# EAGLE design 3w developer dcdc test (EAGLE 5.07)
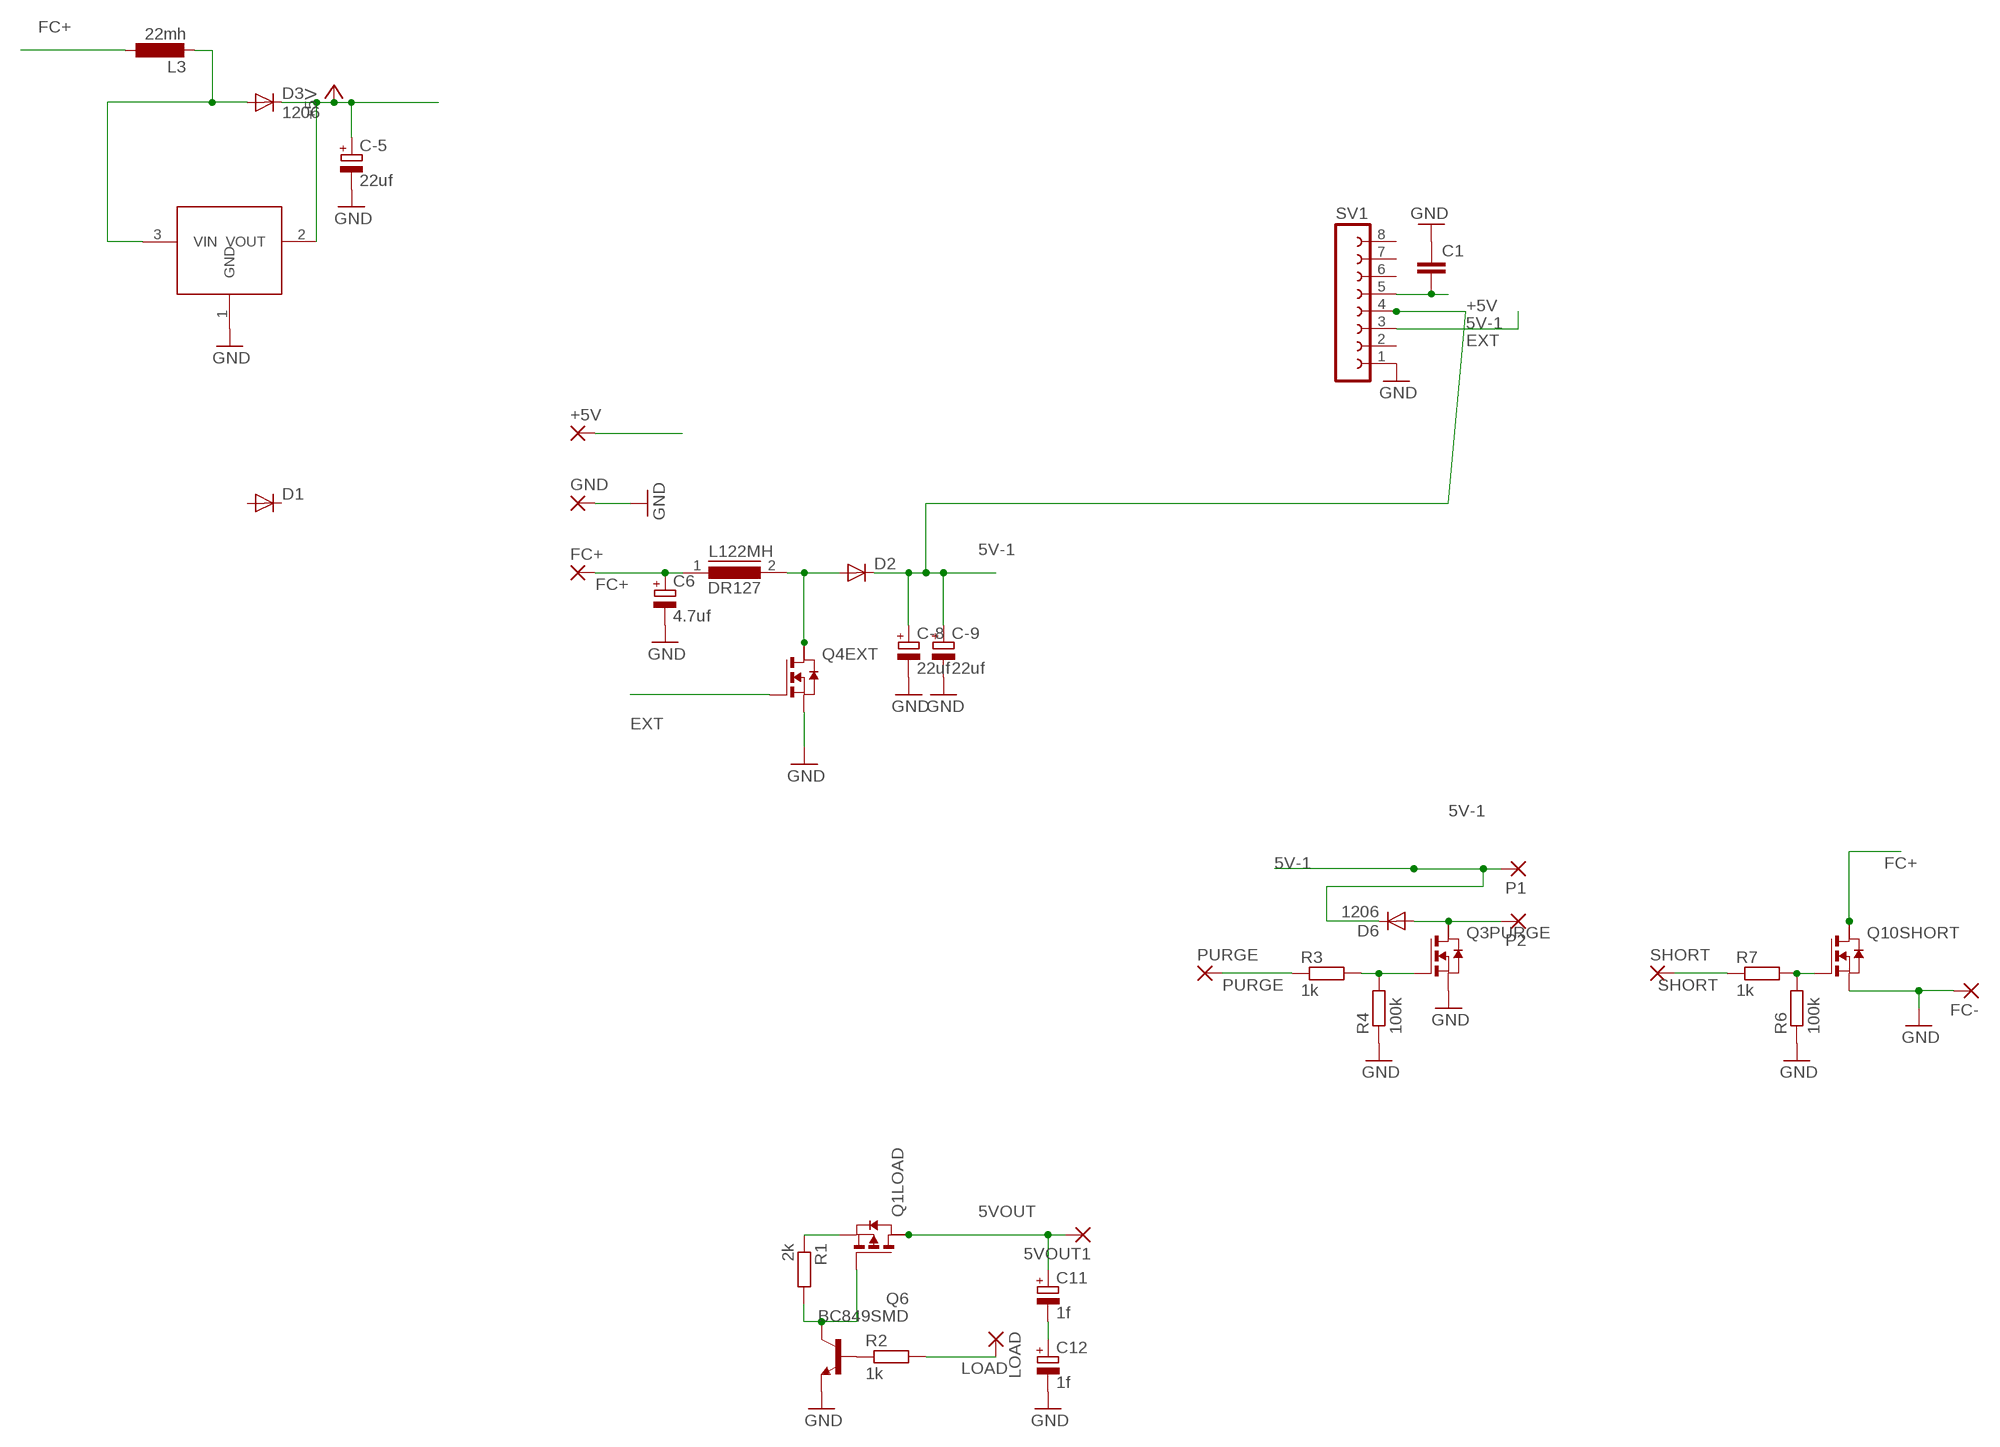
[diagram p0: schematic, sheet 1]

## Parts
5VOUT1  2,54/1,1  [2,54/1,1]
+5V  2,54/1,1  [2,54/1,1]
C1  C-EUC1206  [C1206]
C6  4.7uf  CPOL-EUSMCC  [SMC_C]
C11  1f  CPOL-EUE5-10.5  [E5-10,5]
C12  1f  CPOL-EUE5-10.5  [E5-10,5]
C-5  22uf  CPOL-EUSMCD  [SMC_D]
C-8  22uf  CPOL-EUSMCD  [SMC_D]
C-9  22uf  CPOL-EUSMCC  [SMC_C]
D1  DIODE-DO214AA  [DO214AA]
D2  DIODE-DO214AA  [DO214AA]
D3  1206  DIODE-DO214AA  [DO214AA]
D6  1206  DIODE-GF1  [GF1]
FC+  2,54/1,1  [2,54/1,1]
FC-  2,54/1,1  [2,54/1,1]
GND  2,54/1,1  [2,54/1,1]
L3  22mh  L-EU  [MURATA-45223]
L122MH  DR127  [DR127]
LOAD  2,54/1,1  [2,54/1,1]
P1  2,54/1,1  [2,54/1,1]
P2  2,54/1,1  [2,54/1,1]
PURGE  2,54/1,1  [2,54/1,1]
Q1LOAD  PMOSSOT223  [SOT223]
Q3PURGE  NMOSSOT223  [SOT223]
Q4EXT  NMOSSOT223  [SOT223]
Q6  BC849SMD  [SOT23-BEC]
Q10SHORT  NMOSSOT223  [SOT223]
R1  2k  R-EU_M1206  [M1206]
R2  1k  R-EU_M1206  [M1206]
R3  1k  R-EU_M1206  [M1206]
R4  100k  R-EU_M1206  [M1206]
R6  100k  R-EU_M1206  [M1206]
R7  1k  R-EU_M1206  [M1206]
SHORT  2,54/1,1  [2,54/1,1]
SV1  FE08-1  [FE08]
U$2  MINIPAK-7750  [SOT89]

## Nets
5V-1: C-8.+ C-9.+ D2.C D6.C P1.1(P) Q1LOAD.3(S) R1.1 SV1.4
5VOUT: 5VOUT1.1(P) C11.+ Q1LOAD.2(D)
+5V [medpower]: +5V.1(P) C1.2 C-5.+ D3.C SV1.5 U$2.2(VOUT)
EXT: Q4EXT.1(G) SV1.3
FC+: C6.+ FC+.1(P) L3.P$1 L122MH.1 Q10SHORT.2(D)
GND: C1.1 C6.- C12.- C-5.- C-8.- C-9.- FC-.1(P) GND.1(P) Q3PURGE.3(S) Q4EXT.3(S) Q6.E Q10SHORT.3(S) R4.1 R6.1 SV1.1 U$2.1(GND)
LOAD: LOAD.1(P) R2.2
N$2: Q1LOAD.1(G) Q6.C R1.2
N$3: D2.A L122MH.2 Q4EXT.2(D)
N$4: D6.A P2.1(P) Q3PURGE.2(D)
N$5: Q6.B R2.1
N$6: D3.A L3.P$2 U$2.3(VIN)
N$7: Q3PURGE.1(G) R3.2 R4.2
N$8: C11.- C12.+
N$9: Q10SHORT.1(G) R6.2 R7.2
PURGE: PURGE.1(P) R3.1
SHORT: R7.1 SHORT.1(P)
Unconnected: D1.A D1.C Q1LOAD.4(D2) Q3PURGE.4(D2) Q4EXT.4(D2) Q10SHORT.4(D2) SV1.2 SV1.6 SV1.7 SV1.8

## Library data of the parts
5VOUT1 +5V FC+ FC- GND LOAD P1 P2 PURGE SHORT = wirepad:2,54/1,1: THROUGH-HOLE PAD
C1 = matt rcl:C-EU: CAPACITOR, European symbol
C6 C-9 = rcl:CPOL-EU: POLARIZED CAPACITOR, European symbol
C11 C12 C-5 C-8 = matt rcl:CPOL-EU: POLARIZED CAPACITOR, European symbol
D1-D3 D6 = matt diode:DIODE-: DIODE
L3 = matt rcl:L-EU: INDUCTOR, European symbol
L122MH = inductors:DR127: High Power Density, High Efficiency, Shielded Inductors Source: coiltronics_dr_series.pdf
Q1LOAD = zetex:PMOSSOT223: MOS FET
Q3PURGE Q4EXT Q10SHORT = zetex:NMOSSOT223: MOS FET
Q6 = matt transistor-npn:BC849*: NPN Transistor
R1-R4 R6 R7 = resistor:R-EU_: RESISTOR, European symbol
SV1 = con-lsta:FE08-1: FEMALE HEADER
U$2 = matt:MINIPAK-7750

## Net classes
1 power: width 3 mm
2 medpower: width 1 mm

## Board
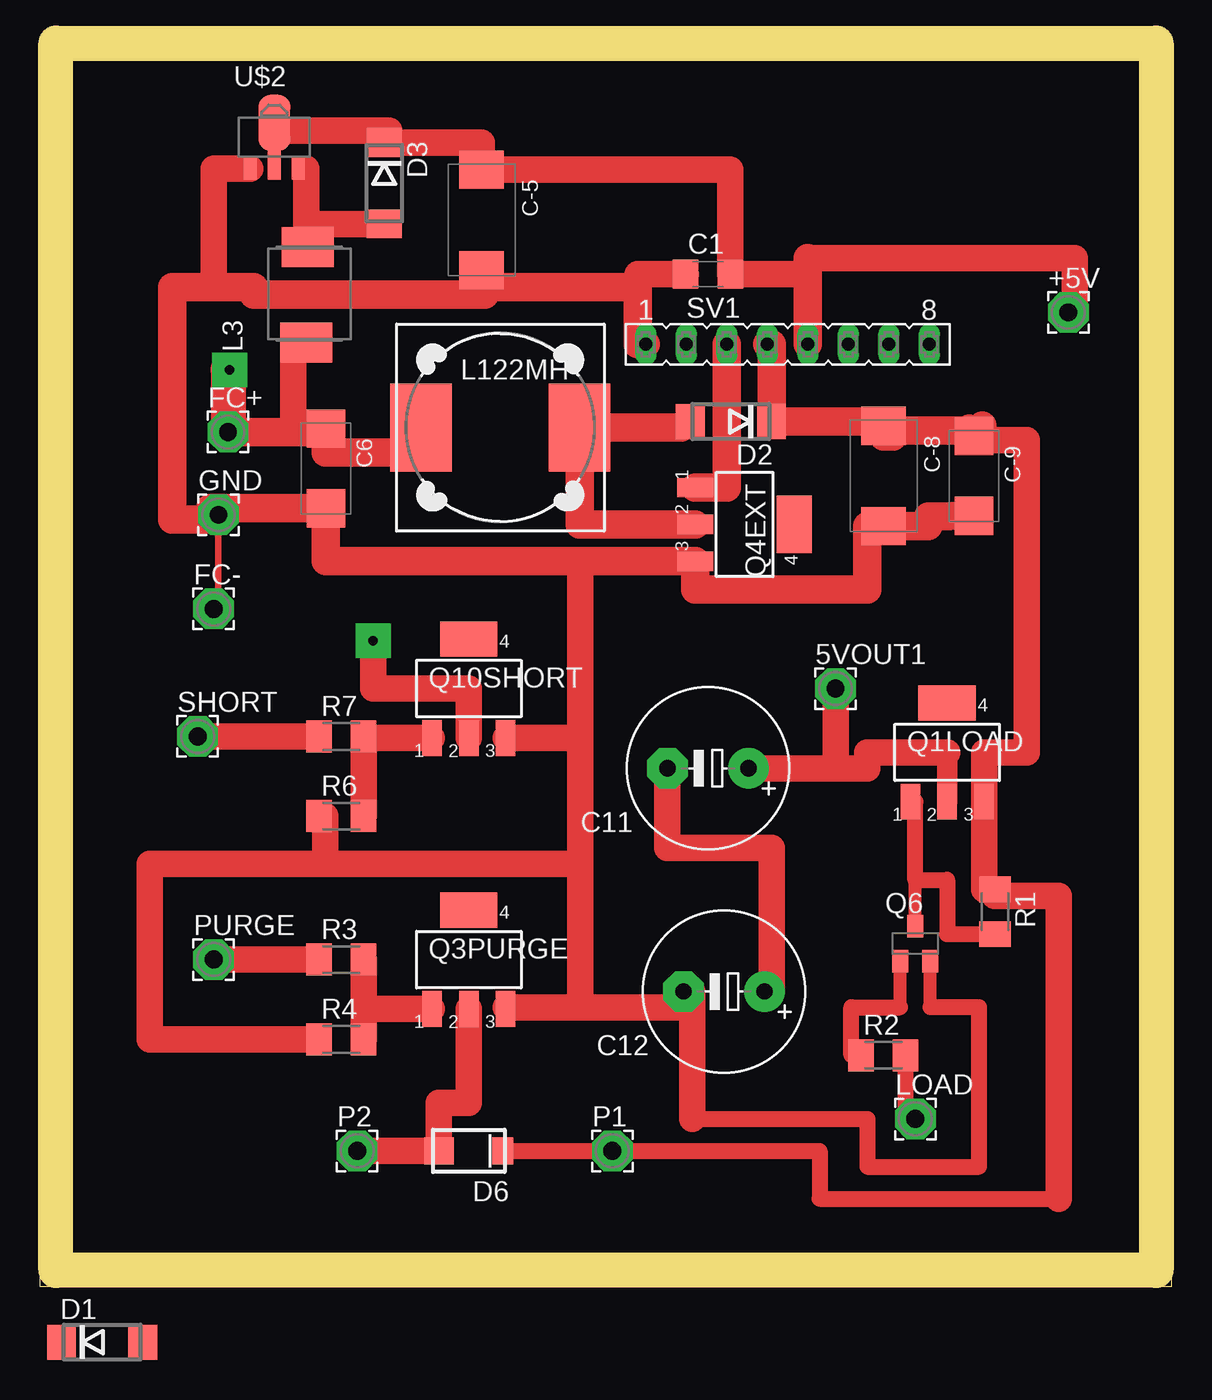
[diagram p1: board, top side]
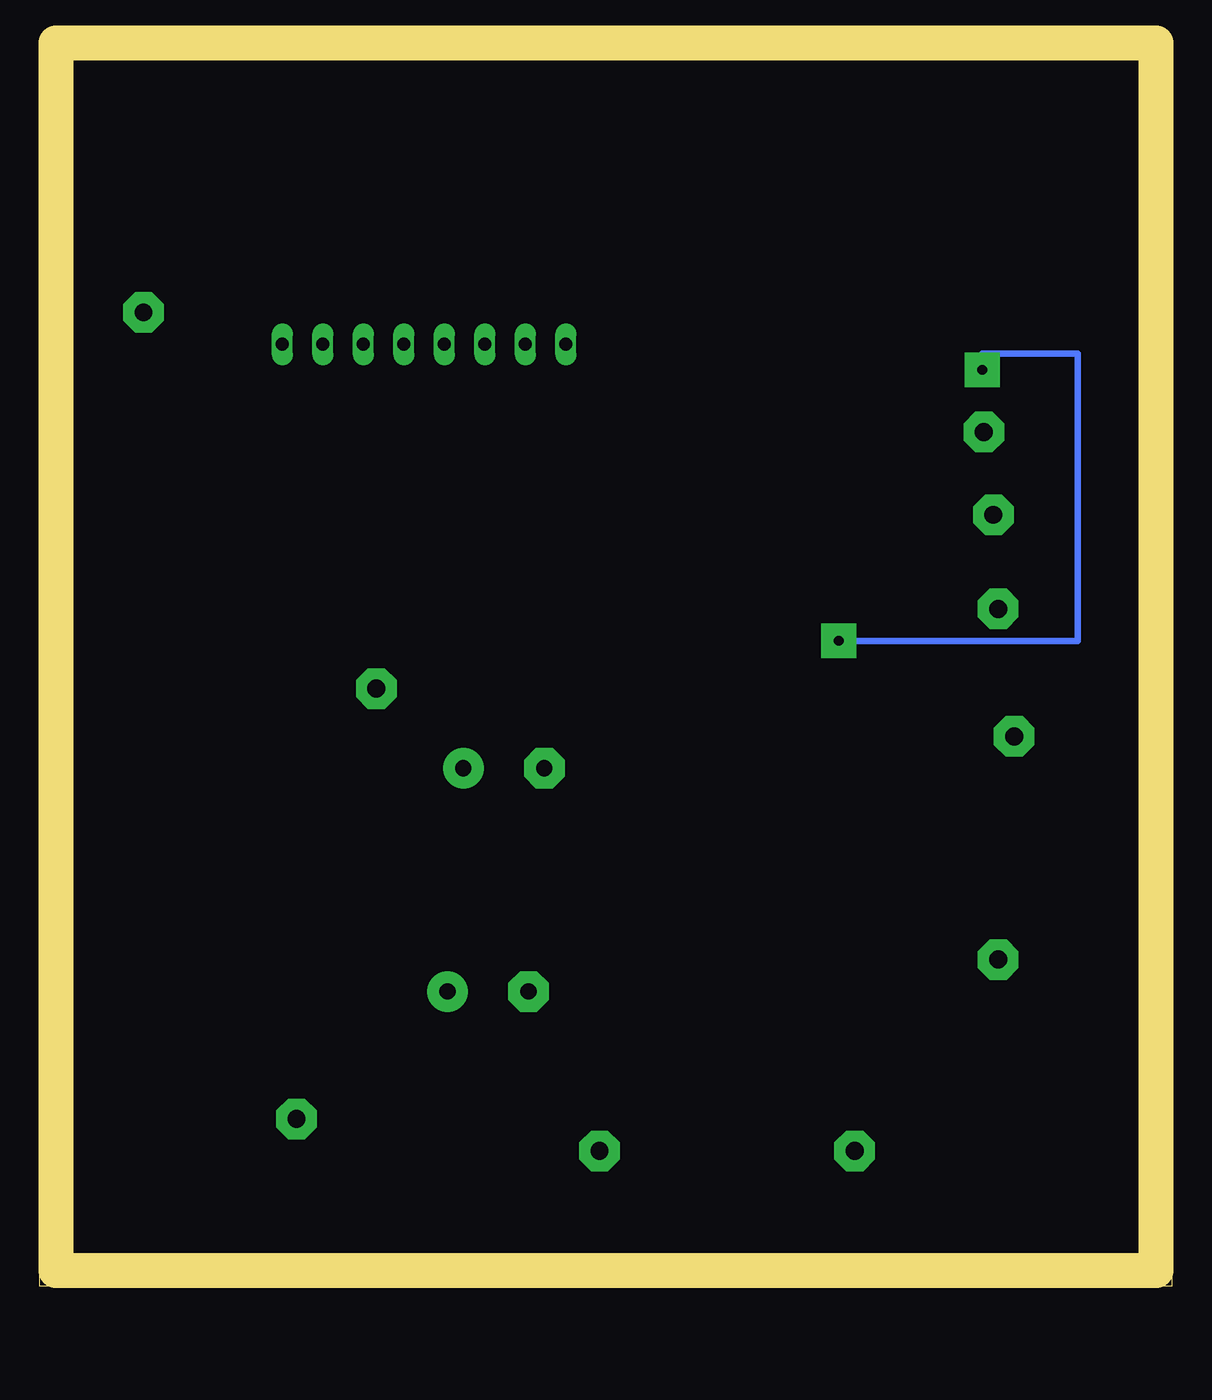
[diagram p2: board, bottom side, seen from below]

Size 71 x 78.2 mm. Coordinates in mm from the lower left corner, seen from the top.
Outline: 0,0 71,0 71,78.2 0,78.2 0,0
Copper layers (1*16): Top 0.035mm / dielectric 1.5mm / Bottom 0.035mm
Design rules "default": minimum track width 10mil, minimum drill 24mil, track to track 8mil, track to pad 8mil, pad to pad 8mil, via to via 8mil, smd to smd 8mil, copper to edge 40mil, drill to drill 8mil, minimum pad ring 10mil, minimum via ring 8mil, stop-mask expansion 4mil, vias tented up to drill 0mil, thermal gap 10mil
Milling: 4 lines

### Footprints (pad centres in the part's own frame; a part is rotated, then mirrored left to right if it is on the bottom)
2,54/1,1 = drill 1.118 pad 2.54 octagon: 1 0,0
C1206 = smd 1.6 x 1.8: 1 -1.4,0; 2 1.4,0
SMC_C = smd 2.4 x 2.4: + -2.5,0; - 2.5,0
E5-10,5 = drill 1.016 pad 2.54 round: + -2.54,0 | drill 1.016 pad 2.54 octagon: - 2.54,0
SMC_D = smd 2.4 x 2.8: + -3.15,0; - 3.15,0
DO214AA = smd 1.8 x 2.2: A 2.55,0; C -2.55,0
GF1 = smd 1.85 x 1.68: A 1.87,0 | smd 1.32 x 1.68: C -2.12,0
MURATA-45223 = smd 2.5 x 3.25: P$1 -3.6,0.2; P$2 2.4,0.1
DR127 = smd 3.85 x 5.5: 1 -4.975,0; 2 4.975,0
SOT223 = smd 1.219 x 2.235: 1 -2.311,-3.099; 2 0,-3.099; 3 2.311,-3.099 | smd 3.6 x 2.2: 4 0,3.099
SOT23-BEC = smd 1 x 1.4: B -0.95,-1.1; C 0,1.1; E 0.95,-1.1
M1206 = smd 1.6 x 2: 1 -1.4,0; 2 1.4,0
FE08 = drill 0.813 long: 1 -8.89,0; 2 -6.35,0; 3 -3.81,0; 4 -1.27,0; 5 1.27,0; 6 3.81,0; 7 6.35,0; 8 8.89,0
SOT89 = smd 0.8 x 1.4: 1 -1.499,-1.981; 3 1.499,-1.981 | smd 0.8 x 1.9: 2 0,-1.727 | smd 2 x 3.5: 2.1 0,0.889

### Placement (x,y rotation side)
5VOUT1  49.9,37.5 0 top
+5V  64.5,61.1 0 top
C1  41.9,63.5 0 top
C6  17.94,51.31 270 top
C11  41.9,32.5 180 top
C12  42.9,18.5 180 top
C-5  27.7,66.9 270 top
C-8  52.91,50.84 270 top
C-9  58.59,50.84 270 top
D1  3.9,-3.5 0 top  (outside the outline)
D2  43.34,54.25 180 top
D3  21.6,69.2 270 top
D6  26.9,8.5 180 top
FC+  11.8,53.6 0 top
FC-  10.9,42.5 0 top
GND  11.2,48.4 0 top
L3  16.9,62.8 90 top
L122MH  28.87,53.88 0 top
LOAD  54.9,10.5 0 top
P1  35.9,8.5 0 top
P2  19.9,8.5 0 top
PURGE  10.9,20.5 0 top
Q1LOAD  56.9,33.5 0 top
Q3PURGE  26.9,20.5 0 top
Q4EXT  44.2,47.8 270 top
Q6  54.9,21.5 0 top
Q10SHORT  26.9,37.5 0 top
R1  59.9,23.5 270 top
R2  52.9,14.5 0 top
R3  18.9,20.5 0 top
R4  18.9,15.5 0 top
R6  18.9,29.5 0 top
R7  18.9,34.5 0 top
SHORT  9.9,34.5 0 top
SV1  46.9,59.1 0 top
U$2  14.7,72.1 0 top

### Tracks (layer width: path | path; a pad name or v marks a point on that pad's centre or on a via)
5V-1
  Top 0.406: D6.C P1.1 | R1.1 59.21,24.9
  Top 1.016: D6.C 48.9,8.5 48.9,5.5 63.9,5.5
  Top 1.676: 59.21,24.9 Q1LOAD.3 59.21,33.5 61.9,33.5 61.9,53.1 59.1,53.1 | 63.9,5.5 63.9,24.5 59.9,24.5 R1.1
  Top 1.778: C-9.+ 59.1,53.99 59.1,53.7 | 59.1,53.7 53.5,53.7 53.5,53.3 52.91,53.3 C-8.+ 52.91,54.25 D2.C 45.89,59.1 SV1.4 | 58.3,53.8 58.3,53.1 59.1,53.1 59.1,53.7
5VOUT
  Top 1.27: 56.9,33.5 Q1LOAD.2
  Top 1.676: C11.+ 49.9,32.5 | 49.9,32.5 51.9,32.5 51.9,33.5 56.9,33.5 | 49.9,32.5 5VOUT1.1
+5V
  Top 0.406: C-5.+ 27.7,70.62 | U$2.2 14.7,72.5
  Top 1.676: 48.17,63.5 C1.2 43.3,70.05 C-5.+ | +5V.1 64.9,61.1 64.9,64.5 48.17,64.5 | 14.7,72.5 21.9,72.5 D3.C 27.7,71.75 27.7,70.62
  Top 1.778: SV1.5 48.17,63.5 48.17,64.5
EXT
  Top 1.778: Q4EXT.1 43.09,50.11 SV1.3
FC+  (via drill 0.6 pad 2.18)
  Top 0.406: 15.9,59.4 L3.P$1 | v11.9,57.5 11.8,57.5
  Top 1.676: 15.9,53.6 15.9,59.4 | Q10SHORT.2 26.9,37.5 20.9,37.5 v20.9,40.5
  Top 1.778: FC+.1 15.9,53.6 17.94,53.6 C6.+ 17.94,52.3 24.7,52.3 24.7,53.1 24.9,53.1 24.9,53.3 24.5,53.3 | L122MH.1 23.5,53.88 23.5,53.5 23.7,53.5 23.7,53.9 24.3,53.9 | 24.3,53.9 24.3,54.9 | 24.3,53.9 24.3,52.5 24.5,52.5 24.5,53.3 | 24.5,54.3 24.5,54.9 23.7,54.9 23.7,54.3 24.5,54.3 | 24.5,53.3 24.5,54.3
  Top 2.184: 11.8,57.5 FC+.1
  Bottom 0.406: v20.9,40.5 5.9,40.5 5.9,58.5 11.9,58.5 v11.9,57.5
GND
  Top 0.406: 37.5,62.7 37.5,63.5 | C-5.- 27.9,63.75 27.9,62.7 | 17.9,29.5 R6.1 | 29.21,17.5 Q3PURGE.3 | FC-.1 11.2,42.5 GND.1 | 40.36,17.5 C12.- 40.9,18.5
  Top 0.813: 55.85,17.5 Q6.E
  Top 1.016: 40.9,10.5 51.9,10.5 51.9,7.5 58.9,7.5 58.9,17.5 55.85,17.5
  Top 1.676: U$2.1 10.9,70.12 10.9,62.7 | 37.5,63.5 C1.1 | 33.9,34.4 Q10SHORT.3 | 33.9,34.4 33.9,45.49 | 17.9,26.5 17.9,29.5 | 33.9,26.5 33.9,34.4 | 17.9,26.5 33.9,26.5 | 33.9,26.5 33.9,17.5 | 33.9,17.5 29.21,17.5 | R4.1 6.9,15.5 6.9,26.5 17.9,26.5 | 33.9,17.5 40.36,17.5 | 40.9,18.5 40.9,10.5 | 37.5,62.7 32.9,62.7
  Top 1.778: C-9.- 55.7,48.3 55.7,47.69 C-8.- 51.9,47.69 51.9,43.7 41.1,43.7 Q4EXT.3 33.9,45.49 17.94,45.49 C6.- 10.7,48.81 10.7,48.1 | SV1.1 37.5,59.1 37.5,62.7 27.9,62.7 27.9,62.2 13.4,62.2 13.4,62.7 10.9,62.7 8.3,62.7 8.3,48.1 10.7,48.1 | 10.7,48.1 11.2,48.1 GND.1
LOAD
  Top 0.406: LOAD.1 54.3,10.5
  Top 1.016: 54.3,10.5 R2.2
N$2
  Top 0.406: 54.9,30.4 Q1LOAD.1
  Top 0.813: Q6.C 54.9,25.5
  Top 1.016: 54.9,30.4 54.9,25.5 56.9,25.5 56.9,22.1 R1.2
N$3
  Top 1.778: D2.A 40.19,53.88 L122MH.2 33.84,47.8 Q4EXT.2
N$4
  Top 1.676: Q3PURGE.2 26.9,11.5 25.03,11.5 D6.A P2.1
N$5
  Top 0.406: R2.1 50.9,14.5
  Top 0.813: 53.95,17.5 Q6.B
  Top 1.016: 50.9,14.5 50.9,17.5 53.95,17.5
N$6
  Top 0.406: 16.7,70.12 U$2.3 | L3.P$2 16.7,66.63
  Top 1.676: 16.7,70.12 16.7,66.63 D3.A
N$7
  Top 0.406: 20.3,17.4 20.3,17.5
  Top 1.676: R4.2 20.3,17.4 Q3PURGE.1 | 20.3,17.5 R3.2
N$8
  Top 0.406: C12.+ 45.9,18.5
  Top 1.676: 45.9,18.5 45.9,27.5 39.36,27.5 C11.-
N$9
  Top 0.406: R7.2 20.3,34.4
  Top 1.676: R6.2 R7.2 | 20.3,34.4 Q10SHORT.1
PURGE
  Top 1.676: PURGE.1 R3.1
SHORT
  Top 1.676: SHORT.1 R7.1